# EAGLE design Wisp5_Harvester_Motor-driver_V2 (EAGLE 8.2.2)

## Sheet 1 of 2
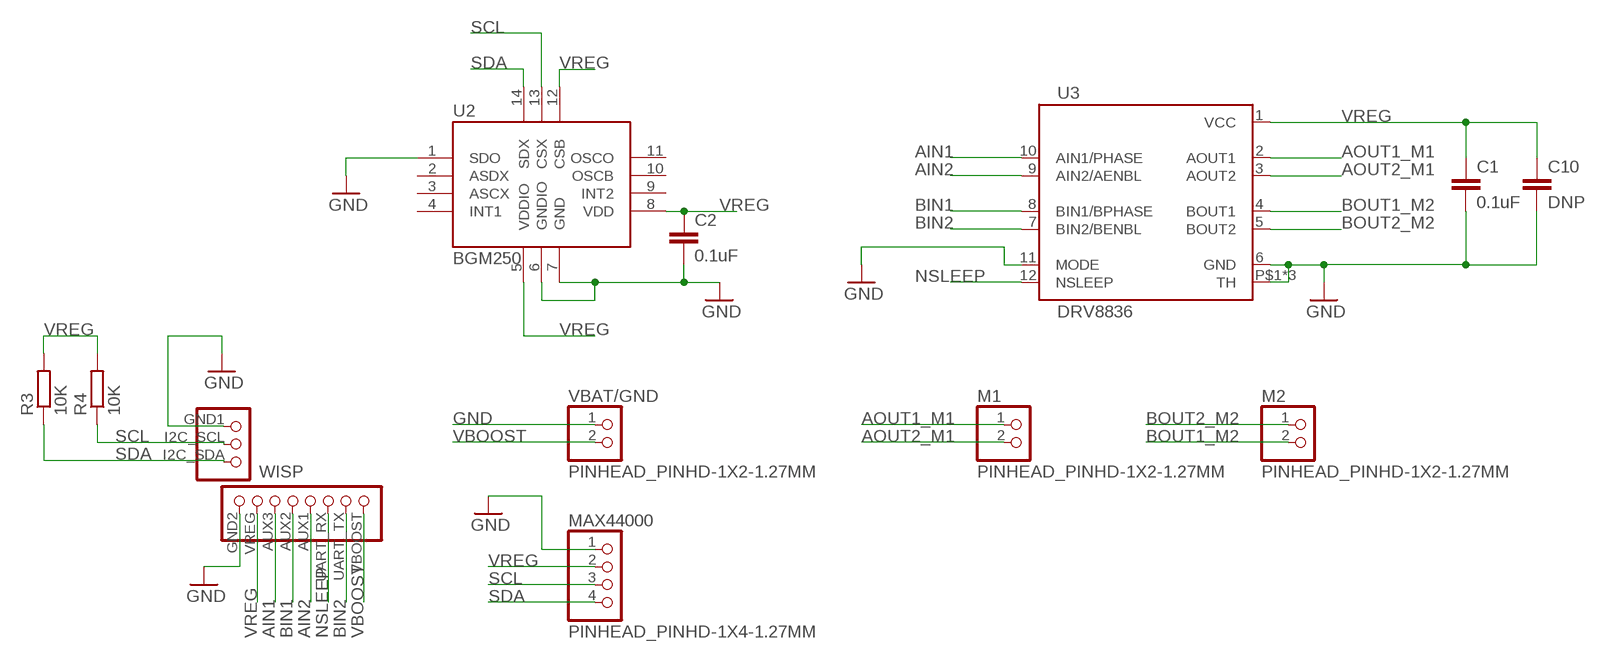
[diagram p0: schematic, sheet 1]

### Parts
C1  0.1uF  C-EUC0805  [C0805]
C2  0.1uF  C-EUC0805  [C0805]
C10  DNP  C-EUC0805  [C0805]
M1  PINHEAD_PINHD-1X2-1.27MM  [PINHEAD_1X02-1.27MM]
M2  PINHEAD_PINHD-1X2-1.27MM  [PINHEAD_1X02-1.27MM]
MAX44000  PINHEAD_PINHD-1X4-1.27MM  [PINHEAD_1X04-1.27MM]
R3  10K  R-EU_R0805  [R0805]
R4  10K  R-EU_R0805  [R0805]
U2  BGM250  [LGA14L]
U3  DRV8836  [12WSON]
VBAT/GND  PINHEAD_PINHD-1X2-1.27MM  [PINHEAD_1X02-1.27MM]
WISP  WISP_HEADER  [PINHEAD_WISP3X8-1.27MM]

### Nets
AIN1: U3.10(AIN1/PHASE) WISP.AUX3
AIN2: U3.9(AIN2/AENBL) WISP.AUX1
AOUT1_M1: M1.1 U3.2(AOUT1)
AOUT2_M1: M1.2 U3.3(AOUT2)
BIN1: U3.8(BIN1/BPHASE) WISP.AUX2
BIN2: U3.7(BIN2/BENBL) WISP.UART_TX
BOUT1_M2: M2.2 U3.4(BOUT1)
BOUT2_M2: M2.1 U3.5(BOUT2)
GND: C1.2 C2.2 C10.2 MAX44000.1 U2.1(SDO) U2.6(GNDIO) U2.7(GND) U3.6(GND) U3.11(MODE) U3.P$1(TH) U3.P$2(TH) U3.TH VBAT/GND.1 WISP.GND1 WISP.GND2 ; also sheet 2
NSLEEP: U3.12(NSLEEP) WISP.UART_RX
SCL: MAX44000.3 R4.1 U2.13(CSX) WISP.I2C_SCL
SDA: MAX44000.4 R3.1 U2.14(SDX) WISP.I2C_SDA
VBOOST: VBAT/GND.2 WISP.VBOOST
VREG: C1.1 C2.1 C10.1 MAX44000.2 R3.2 R4.2 U2.5(VDDIO) U2.8(VDD) U2.12(CSB) U3.1(VCC) WISP.VREG ; also sheet 2
Unconnected: U2.2(ASDX) U2.3(ASCX) U2.4(INT1) U2.9(INT2) U2.10(OSCB) U2.11(OSCO)

## Sheet 2 of 2
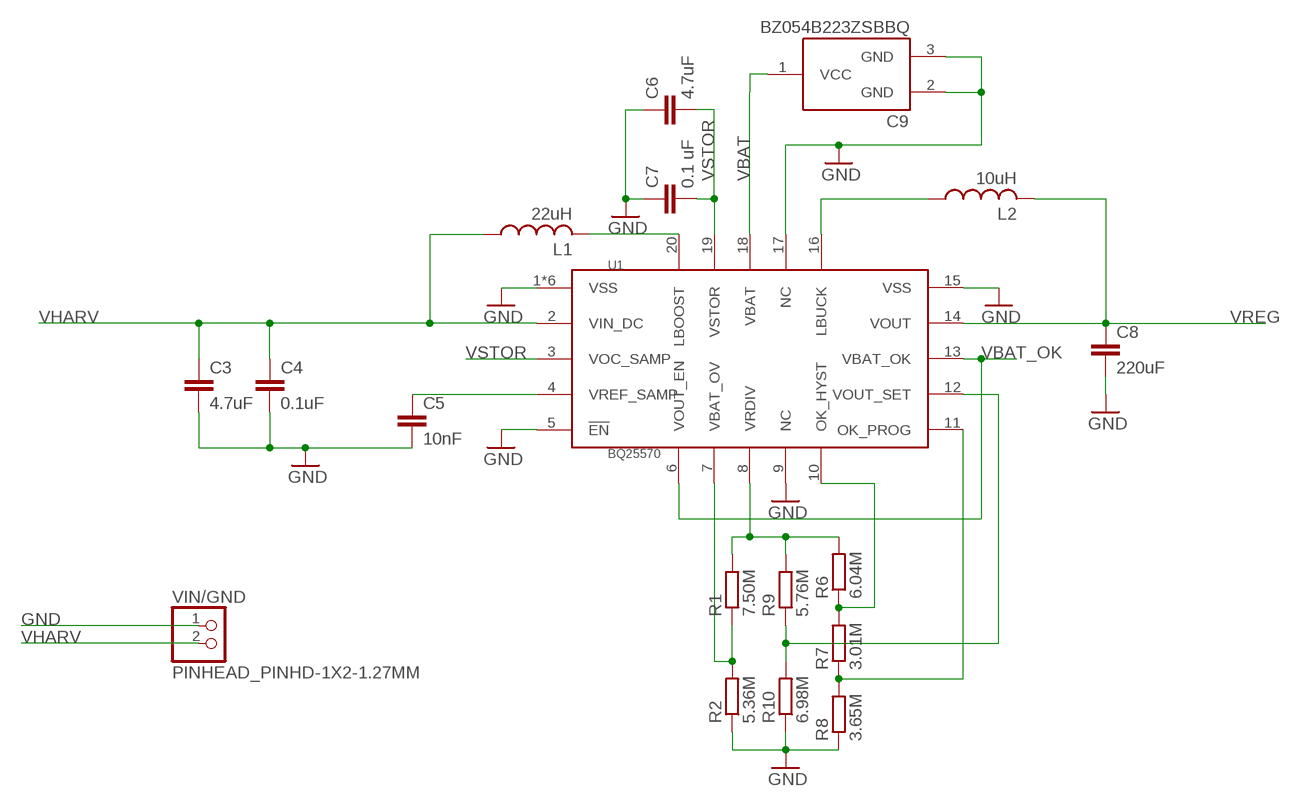
[diagram p1: schematic, sheet 2]

### Parts
C3  4.7uF  C-EUC0805  [C0805]
C4  0.1uF  C-EUC0805  [C0805]
C5  10nF  C-EUC0805  [C0805]
C6  4.7uF  C-EUC0805  [C0805]
C7  0.1 uF  C-EUC0805  [C0805]
C8  220uF  C-EUC1210  [C1210]
C9  BZ054B223ZSBBQ  [BZ05_S-STYLE]
L1  22uH  COILCRAFT-LPS4018  [LPS4018]
L2  10uH  COILCRAFT-LPS4018  [LPS4018]
R1  7.50M  R-EU_R0805  [R0805]
R2  5.36M  R-EU_R0805  [R0805]
R6  6.04M  R-EU_R0805  [R0805]
R7  3.01M  R-EU_R0805  [R0805]
R8  3.65M  R-EU_R0805  [R0805]
R9  5.76M  R-EU_R0805  [R0805]
R10  6.98M  R-EU_R0805  [R0805]
U1  BQ25570  [VQFN20]
VIN/GND  PINHEAD_PINHD-1X2-1.27MM  [PINHEAD_1X02-1.27MM]

### Nets
GND: C3.2 C4.2 C5.2 C6.1 C7.1 C8.2 C9.2(GND) C9.3(GND) R2.1 R8.1 R10.1 U1.1(VSS) U1.5(!EN) U1.9(NC) U1.15(VSS) U1.17(NC) U1.PWR_PAD1(VSS) U1.PWR_PAD2(VSS) U1.PWR_PAD3(VSS) U1.PWR_PAD4(VSS) U1.PWR_PAD(VSS) VIN/GND.1 ; also sheet 1
N$1: R9.1 R10.2 U1.12(VOUT_SET)
N$2: R1.2 R6.2 R9.2 U1.8(VRDIV)
N$4: L1.2 U1.20(LBOOST)
N$9: C5.1 U1.4(VREF_SAMP)
N$10: R6.1 R7.2 U1.10(OK_HYST)
N$12: L2.1 U1.16(LBUCK)
N$13: R1.1 R2.2 U1.7(VBAT_OV)
N$18: R7.1 R8.2 U1.11(OK_PROG)
VBAT: C9.1(VCC) U1.18(VBAT)
VBAT_OK: U1.6(VOUT_EN) U1.13(VBAT_OK)
VHARV: C3.1 C4.1 L1.1 U1.2(VIN_DC) VIN/GND.2
VREG: C8.1 L2.2 U1.14(VOUT) ; also sheet 1
VSTOR: C6.2 C7.2 U1.3(VOC_SAMP) U1.19(VSTOR)

## Library data of the parts
C1-C7 C10 = rcl:C-EU: CAPACITOR, European symbol
C8 = Wisp5_Harvester_Motor-driver_V2:C-EU: CAPACITOR, European symbol
C9 = Wisp5_Harvester_Motor-driver_V2:BZ054B223ZSBBQ
L1 L2 = Wisp5_Harvester_Motor-driver_V2:COILCRAFT-LPS4018: Coilcraft Shielded SMT Power Inductors ? LPS4018 Series
M1 M2 VBAT/GND VIN/GND = Wisp5_Harvester_Motor-driver_V2:PINHEAD_PINHD-1X2-1.27MM
MAX44000 = Wisp5_Harvester_Motor-driver_V2:PINHEAD_PINHD-1X4-1.27MM
R1-R4 R6-R10 = resistor:R-EU_: RESISTOR, European symbol
U1 = Wisp5_Harvester_Motor-driver_V2:BQ25570
U2 = Wisp5_Harvester_Motor-driver_V2:BGM250
U3 = Wisp5_Harvester_Motor-driver_V2:DRV8836: Dual low voltage H-Bridge IC
WISP = Wisp5_Harvester_Motor-driver_V2:WISP_HEADER

## Board
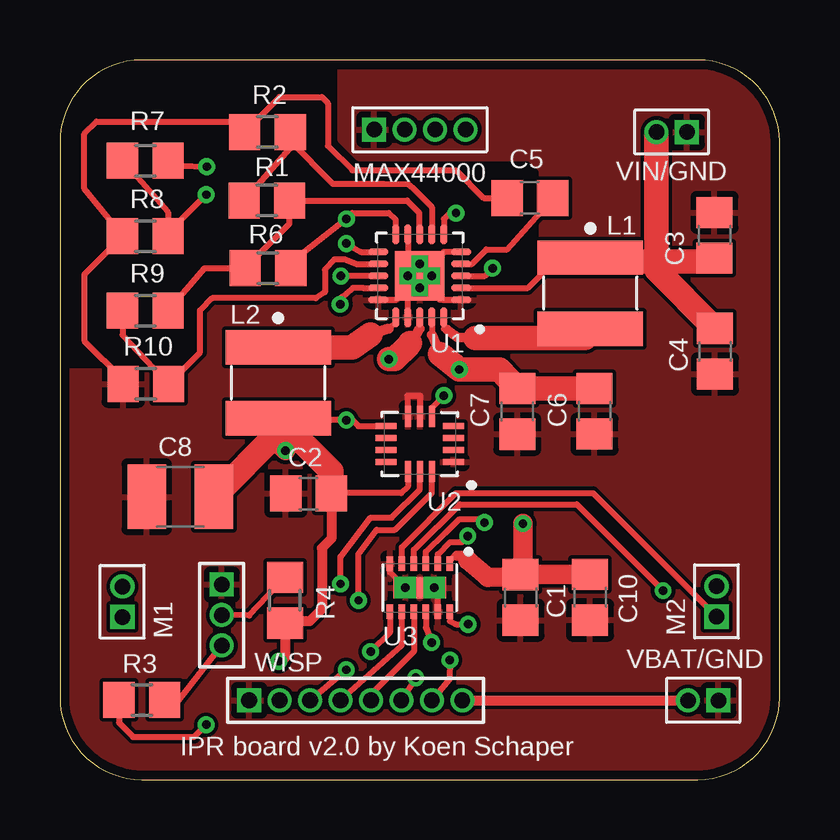
[diagram p2: board, top side]
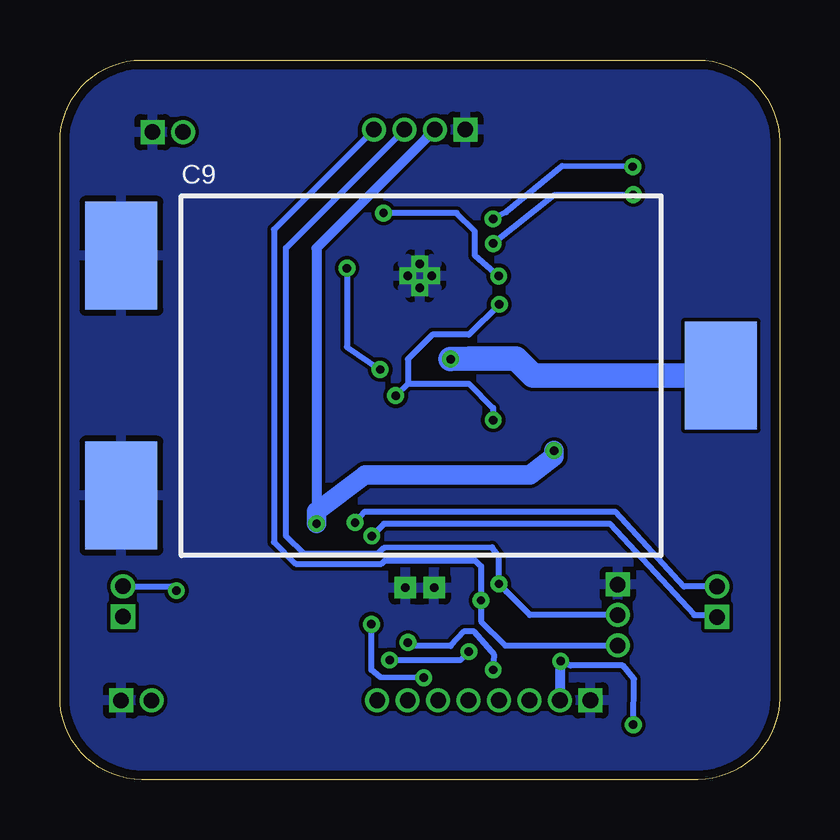
[diagram p3: board, bottom side, seen from below]

Size 30 x 30 mm. Coordinates in mm from the lower left corner, seen from the top.
Outline: 0,26.59 0,3.41 arc90 3.41,0 26.59,0 arc90 30,3.41 30,26.59 arc90 26.59,30 3.41,30 arc90 0,26.59
Copper layers (1*16): Top 0.0356mm / dielectric 1.5011mm / Bottom 0.0356mm
Design rules "LaenPCBOrder *": minimum track width 6mil, minimum drill 13mil, track to track 6mil, track to pad 6mil, pad to pad 6mil, via to via 6mil, smd to smd 6mil, copper to edge 15mil, drill to drill 6mil, minimum pad ring 7mil, minimum via ring 7mil, stop-mask expansion 3mil, vias tented up to drill 14mil, thermal gap 10mil

### Footprints (pad centres in the part's own frame; a part is rotated, then mirrored left to right if it is on the bottom)
C0805 = smd 1.3 x 1.5: 1 -0.95,0; 2 0.95,0
C1210 = smd 1.6 x 2.7: 1 -1.4,0; 2 1.4,0
BZ05_S-STYLE = smd 3 x 4.5: 1 12.5,0; 2 -12.5,5; 3 -12.5,-5
LPS4018 = smd 1.435 x 4.394: 1 -1.48,0; 2 1.48,0
PINHEAD_1X02-1.27MM = drill 0.65 square: 1 0,0 | drill 0.65: 2 1.27,0
PINHEAD_1X04-1.27MM = drill 0.65 square: 1 0,0 | drill 0.65: 2 1.27,0; 3 2.54,0; 4 3.81,0
R0805 = smd 1.3 x 1.5: 1 -0.95,0; 2 0.95,0
VQFN20 = smd 0.85 x 0.28: 1 -1.725,1; 2 -1.725,0.5; 3 -1.725,0; 4 -1.725,-0.5; 5 -1.725,-1; 11 1.725,-1; 12 1.725,-0.5; 13 1.725,0; 14 1.725,0.5; 15 1.725,1 | smd 0.28 x 0.85: 6 -1,-1.725; 7 -0.5,-1.725; 8 0,-1.725; 9 0.5,-1.725; 10 1,-1.725; 16 1,1.725; 17 0.5,1.725; 18 0,1.725; 19 -0.5,1.725; 20 -1,1.725 | smd 2.05 x 2.05: PWR_PAD 0,0 | drill 0.35 square: PWR_PAD1 0,0.5; PWR_PAD2 0.5,0; PWR_PAD3 0,-0.5; PWR_PAD4 -0.5,0
LGA14L = smd 0.875 x 0.25: 1 -1.4,0.75; 2 -1.4,0.25; 3 -1.4,-0.25; 4 -1.4,-0.75; 8 1.4,-0.75; 9 1.4,-0.25; 10 1.4,0.25; 11 1.4,0.75 | smd 0.25 x 0.875: 5 -0.5,-1.15; 6 0,-1.15; 7 0.5,-1.15; 12 0.5,1.15; 13 0,1.15; 14 -0.5,1.15
12WSON = smd 0.28 x 0.6: 1 -1.25,-1; 2 -0.75,-1; 3 -0.25,-1; 4 0.25,-1; 5 0.75,-1; 6 1.25,-1; 7 1.25,1; 8 0.75,1; 9 0.25,1; 10 -0.25,1; 11 -0.75,1; 12 -1.25,1 | drill 0.35 pad 0.9 square: P$1 -0.6,0; P$2 0.6,0 | smd 2.2 x 0.9: TH 0,0
PINHEAD_WISP3X8-1.27MM = drill 0.65: AUX1 7.493,1.27; AUX2 6.223,1.27; AUX3 4.953,1.27; I2C_SCL 1.27,4.826; I2C_SDA 1.27,3.556; UART_RX 8.763,1.27; UART_TX 10.033,1.27; VBOOST 11.303,1.27; VREG 3.683,1.27 | drill 0.65 square: GND1 1.27,6.096; GND2 2.413,1.27

### Placement (x,y rotation side)
C1  19.21,7.59 270 top
C2  10.37,11.92 180 top
C3  27.29,22.69 90 top
C4  27.31,17.86 270 top
C5  19.59,24.25 180 top
C6  22.29,15.35 90 top
C7  19.06,15.35 90 top
C8  5.02,11.79 180 top
C9  14.94,16.84 0 bottom
C10  22.1,7.6 270 top
L1  22.11,20.28 270 top
L2  9.1,16.54 270 top
M1  2.6,6.78 90 top
M2  27.38,6.79 90 top
MAX44000  13.1,27.1 0 top
R1  8.62,24.14 0 top
R2  8.65,26.99 0 top
R3  3.41,3.31 180 top
R4  9.38,7.47 270 top
R6  8.67,21.32 180 top
R7  3.56,25.8 0 top
R8  3.56,22.65 0 top
R9  3.56,19.55 0 top
R10  3.58,16.5 0 top
U1  15,21 180 top
U2  15,13.98 180 top
U3  15,8 180 top
VBAT/GND  27.45,3.3 180 top
VIN/GND  26.14,26.99 180 top
WISP  5.47,2.03 0 top

### Tracks (layer width: path | path; a pad name or v marks a point on that pad's centre or on a via)
AIN1  (via drill 0.35)
  Top 0.254: U3.10 15.25,6.34 v15.49,5.71 | v11.94,4.57 11.95,4.57 WISP.AUX3
  Bottom 0.254: v11.94,4.57 11.91,5.21 11.99,5.33 12.73,6.17 13.16,6.17 13.71,5.57 15.35,5.57 v15.49,5.71
AIN2
  Top 0.254: U3.9 14.75,5.34 12.97,3.56 WISP.AUX1
AOUT1_M1  (via drill 0.35)
  Top 0.254: U3.2 15.75,9.39 16.26,9.9 16.75,9.9 v17,10.15
  Bottom 0.254: M1.1 2.77,6.86 3.56,6.86 7.08,10.66 16.49,10.66 v17,10.15
AOUT2_M1  (via drill 0.35)
  Top 0.254: U3.3 15.25,9.5 16.07,10.27 16.67,10.86 17.55,10.86 v17.7,10.71
  Bottom 0.254: M1.2 3.98,8.04 6.85,11.17 9.14,11.17 10.92,11.18 17.29,11.18 v17.7,10.71
BIN1
  Top 0.254: WISP.AUX2 14.25,5.6 U3.8
BIN2  (via drill 0.35)
  Top 0.254: U3.7 13.75,6.13 v12.95,5.33 | v16.26,4.98 16.24,4.18 WISP.UART_TX
  Bottom 0.254: v12.95,5.33 13.31,4.98 v16.26,4.98
BOUT1_M2  (via drill 0.35)
  Top 0.254: U3.4 14.75,9.58 16.67,11.47 21.55,11.47 v25.15,7.87
  Bottom 0.254: M2.2 25.33,8.06 v25.15,7.87
BOUT2_M2
  Top 0.254: U3.5 14.25,9.68 16.51,11.94 22.23,11.94 M2.1
GND
  Top 0.254: U1.15 14,20 14.92,20.92 | U1.PWR_PAD 14.92,20.92 | U1.1 15.84,20 14.92,20.92 | U1.9 14.5,21.5 U1.PWR_PAD | U1.5 16,22 U1.PWR_PAD | U1.17 14.5,20.5 U1.PWR_PAD | U2.7 14.5,15.98 14.48,16 15.01,16 15.01,15.15 U2.6 | U3.11 15.75,7.85 U3.P$1 | U3.6 13.75,8.65 U3.P$2 | C5.2 17.66,24.25 16.51,25.4 12.19,25.4 11.18,26.42 11.18,28.19 10.92,28.45 9.16,28.45 R2.1 7.11,27.43 1.52,27.43 1.02,26.92 1.02,24.64 1.65,23.85 R8.1 1.02,21.05 1.02,18.29 2.63,16.67 R10.1
  pour Bottom: 0,26.55 0,3.42 arc90 3.42,0 26.5,0 arc90 29.97,3.47 29.97,26.5 arc90 26.5,29.97 3.42,29.97 arc90
  pour Top: 11.68,29.97 11.68,26.67 12.45,25.91 19.56,25.91 20.07,25.4 20.07,21.08 19.05,20.07 6.6,20.07 5.84,19.3 5.84,17.78 5.08,17.02 0,17.02 0,3.47 arc90 3.47,0 26.55,0 arc90 29.97,3.42 29.97,26.55 arc90 26.55,29.97
N$1
  Top 0.254: R9.1 2.61,18.54 R10.2 5.84,17.81 5.84,19.56 6.35,20.07 10.67,20.07 11.05,20.32 11.05,21.26 11.45,21.68 11.87,21.68 12.35,21.5 U1.12
N$2
  Top 0.254: U1.8 14.99,22.74 14.99,23.62 14.47,24.14 R1.2 9.57,23.17 R6.2 | R9.2 6.03,21.32 R6.2 | R6.2 7.7,21.09
N$4
  Top 0.254: U1.20 16,18.8 16.15,18.75
  Top 0.406: 16.15,18.75 16.55,18.45 17.32,18.4
  Top 1.016: 17.32,18.4 21.89,18.4 L1.2
N$9
  Top 0.254: U1.4 17.18,21.5 17.78,22.1 18.64,22.1 C5.1
N$10  (via drill 0.35)
  Top 0.254: U1.10 14,23.34 13.72,23.62 12.19,23.62 v11.95,23.38 9.62,21.56 R6.1 | R7.2 5.02,25.59 v6.12,25.55
  Bottom 0.254: v6.12,25.55 9.07,25.58 11.4,23.65 v11.95,23.38
N$12
  Top 0.254: U1.16 14,19.08 13.72,18.8
  Top 0.406: 13.72,18.8 12.95,18.54
  Top 1.016: 12.95,18.54 12.18,18.02 L2.1
N$13
  Top 0.254: U1.7 15.5,23.87 14.7,24.67 14.51,24.82 13.5,24.84 11.37,24.84 9.62,26.62 R2.2 9.6,26.32 R1.1
N$18  (via drill 0.35)
  Top 0.254: R7.1 4.51,23.65 R8.2 4.51,22.8 v6.1,24.38 | v11.94,22.35 12.54,22 U1.11
  Bottom 0.254: v6.1,24.38 9.4,24.36 v11.94,22.35
NSLEEP  (via drill 0.35)
  Top 0.254: WISP.UART_RX 14.24,3.31 v14.83,4.24 | U3.12 16.25,6.61 16.51,6.48 v17.02,6.48
  Bottom 0.254: v14.83,4.24 16.64,4.27 17.02,4.57 v17.02,6.48
SCL  (via drill 0.35)
  Top 0.254: R4.1 7.89,6.84 WISP.I2C_SCL | U2.13 15.01,12.3 15.01,12.1 13.83,10.92 12.95,10.92 11.7,9.28 v11.7,8.16
  Bottom 0.254: WISP.I2C_SCL 10.41,6.86 11.39,7.84 v11.7,8.16 11.7,9.28 11.99,9.68 16.51,9.65 16.76,9.4 19.81,9.4 20.57,10.16 20.57,22.17 MAX44000.3
SDA  (via drill 0.35)
  Top 0.254: R3.1 4.94,3.31 WISP.I2C_SDA | U2.14 15.5,11.94 13.97,10.41 13.21,10.41 12.45,9.4 v12.45,7.47
  Bottom 0.254: WISP.I2C_SDA 11.43,5.59 12.45,6.6 v12.45,7.47 12.45,8.89 12.7,9.14 16.44,9.14 16.6,8.99 20.17,8.99 21.08,9.91 21.08,22.93 MAX44000.4
VBAT  (via drill 0.35)
  Top 0.254: 15,18.8 U1.18
  Top 0.406: 15,18.8 14.74,18.28 14.34,17.88 14.6,18.19
  Top 1.016: 14.6,18.19 14.51,18.08 13.96,17.53 v13.72,17.53
  Bottom 1.016: C9.1 10.29,16.84 11,17.55 12.93,17.55 v13.72,17.53
VBAT_OK  (via drill 0.35)
  Top 0.254: v16.51,23.62 16.26,23.62 16,23.37 16,22.47 U1.6 | U1.13 v11.71,21
  Bottom 0.254: v11.71,21 12.7,21.84 12.7,22.86 13.46,23.62 v16.51,23.62
VBOOST
  Top 0.406: WISP.VBOOST 22.86,3.3 | 22.86,3.3 23.37,3.3 | 22.86,3.3 VBAT/GND.2
VHARV
  Top 0.254: U1.2 19.5,20.5 21,22 21.87,22 L1.1
  Top 1.016: 24.87,21.59 24.87,21.25 C4.1 | 24.87,21.59 VIN/GND.2 | 24.87,21.59 27.14,21.59 C3.1 | 24.87,21.59 22.28,21.59 L1.1
VREG  (via drill 0.35)
  Top 0.254: U2.5 15.5,15.5 v16,16 | U2.12 14.5,12.21 14.22,11.94 11.34,11.94 C2.1 | U3.1 16.25,9.14 16.5,9.39 16.55,9.34 | 16.82,9.34 17.02,9.14 | U1.14 12.64,20.5 12.21,20.5 11.96,20.27 11.68,20.07 v11.68,19.81 | U2.8 12.45,14.73 12.19,14.99 v11.94,14.99 9.17,14.99 L2.2 | R3.2 2.46,2.37 3.05,1.78 5.59,1.78 v6.1,2.29
  Top 0.406: 16.55,9.34 16.82,9.34 | C2.1 11.32,10.05 10.92,9.65 10.92,7.11 10.41,6.6 9.46,6.6 R4.2 9.38,5.07 9.14,4.83 9.14,4.91 v9.12,4.93
  Top 0.813: L2.2 9.1,14.02 v9.4,13.72 | 19.3,8.45 v19.3,10.67 | 19.3,8.45 18.8,8.7 C1.1 | 17.02,9.14 17.84,8.43 19.3,8.45 | C10.1 19.41,8.55 19.3,8.45
  Top 1.016: C8.1 9.1,14.46 L2.2 11.32,12.84 C2.1
  Bottom 0.254: 15.49,16.51 v16,16 | 15.49,16.51 12.95,16.51 11.94,15.49 v11.94,14.99 | v6.1,2.29 6.07,4.19 6.53,4.75 8.71,4.75 v9.12,4.93 v9.13,4.94 | WISP.VREG 9.14,3.31 | v11.68,19.81 12.95,18.54 14.48,18.54 15.49,17.53 15.49,16.51
  Bottom 0.406: MAX44000.2 14.73,26.74 14.73,26.72 19.3,22.15 v19.3,10.67 | v9.12,4.93 9.14,4.91 9.14,3.31
  Bottom 0.813: v9.4,13.72 9.4,13.46 10.41,12.7 17.27,12.7 19.3,11.18 v19.3,10.67
VSTOR  (via drill 0.35)
  Top 0.254: U1.19 15.5,18.54 | U1.3 17.71,21 v18.03,21.32
  Top 0.406: 15.5,18.54 15.85,17.73
  Top 1.016: 15.85,17.73 v16.65,17.09 18.32,17.1 C7.2 | C7.2 19.07,16.4 | C6.2 C7.2
  Bottom 0.254: v18.03,21.32 18.03,18.03 v16.65,17.09

### Text on the board
tNames: L1 | L2 | U2 | IPR board v2.0 by Koen Schaper